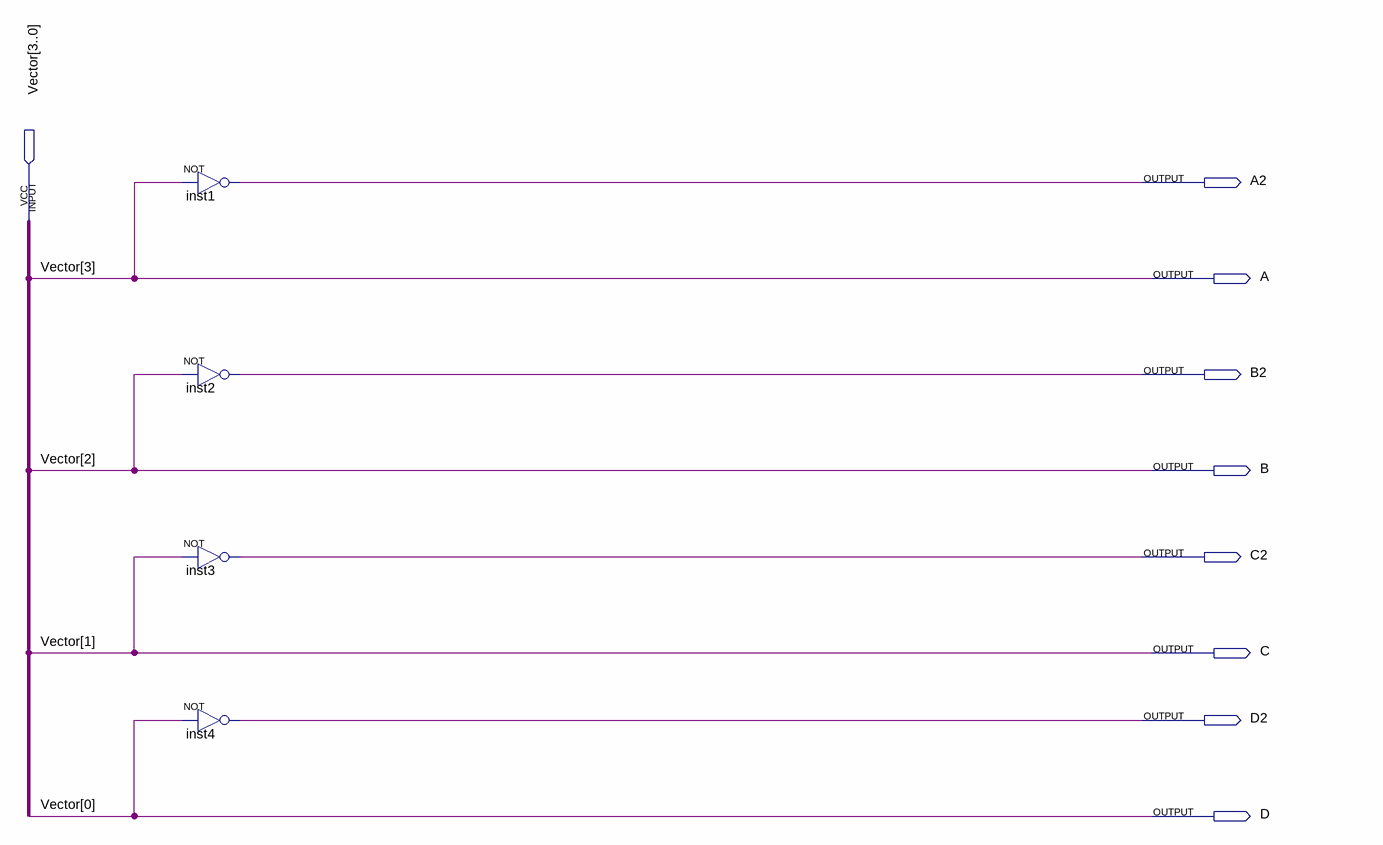
[diagram p0: schematic sheet]
// Quartus schematic all_entradas_4bits.bdf as structural Verilog: 4 symbols, 9 pins
module all_entradas_4bits (
  input  [3:0] Vector,
  output A2,
  output A,
  output B2,
  output B,
  output C2,
  output C,
  output D2,
  output D
);

  not inst1 (A2, Vector[3]);
  not inst2 (B2, Vector[2]);
  not inst3 (C2, Vector[1]);
  not inst4 (D2, Vector[0]);

  assign A = Vector[3];
  assign B = Vector[2];
  assign C = Vector[1];
  assign D = Vector[0];
endmodule
